# Altium schematic sheet buck-boost-converter.SchDoc
size A3; DocumentNumber: 42; SheetNumber: 42; SheetTotal: 45; SheetDescription: Buck-boost Converter
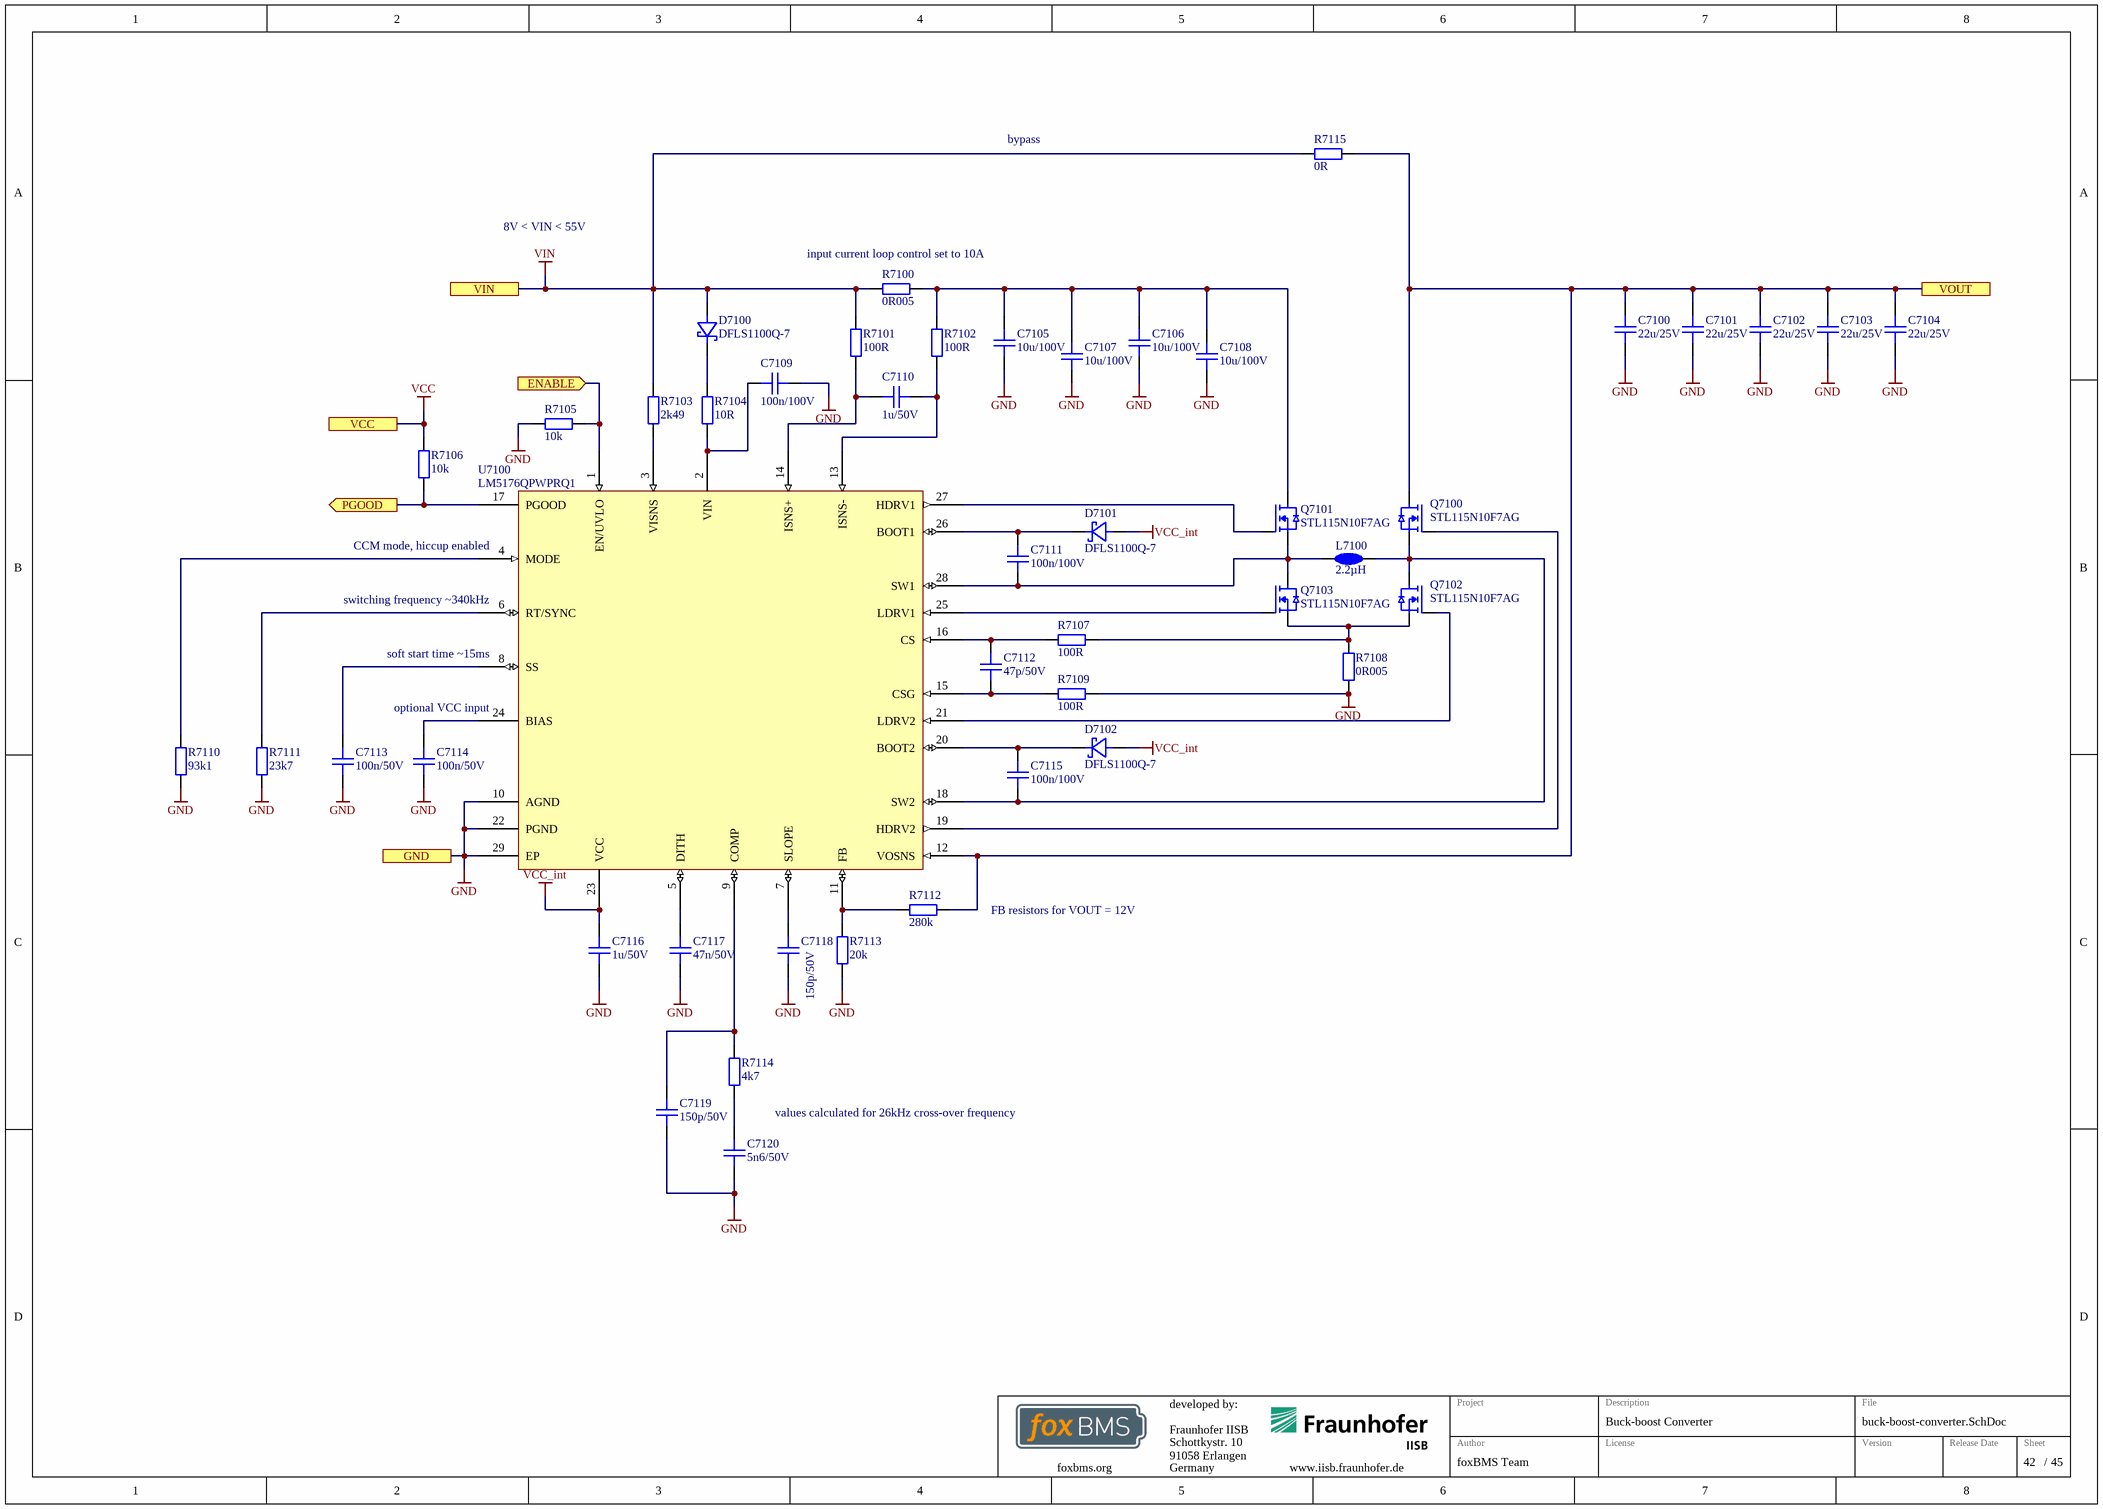
[diagram p0: buck-boost-converter.SchDoc]

## Parts
C7100  22u/25V  [CAPC3225X25N]
C7101  22u/25V  [CAPC3225X25N]
C7102  22u/25V  [CAPC3225X25N]
C7103  22u/25V  [CAPC3225X25N]
C7104  22u/25V  [CAPC3225X25N]
C7105  10u/100V  [CAPC5750X28N]
C7106  10u/100V  [CAPC5750X28N]
C7107  10u/100V  [CAPC5750X28N]
C7108  10u/100V  [CAPC5750X28N]
C7109  100n/100V  [CAPC1608X08N]
C7110  1u/50V  [CAPC1608X08N]
C7111  100n/100V  [CAPC1608X08N]
C7112  47p/50V  [CAPC1005X06N]
C7113  100n/50V  [CAPC1005X06N]
C7114  100n/50V  [CAPC1005X06N]
C7115  100n/100V  [CAPC1608X08N]
C7116  1u/50V  [CAPC1608X08N]
C7117  47n/50V  [CAPC1005X06N]
C7118  150p/50V  [CAPC1005X06N]
C7119  150p/50V  [CAPC1005X06N]
C7120  5n6/50V  [CAPC1608X08N]
D7100  DFLS1100Q-7  [PowerDI123]
D7101  DFLS1100Q-7  [PowerDI123]
D7102  DFLS1100Q-7  [PowerDI123]
L7100  2.2µH  [COILCRAFT_XAL1010]
Q7100  STL115N10F7AG  [ST_PowerFLAT_5x6_WF_type_C]
Q7101  STL115N10F7AG  [ST_PowerFLAT_5x6_WF_type_C]
Q7102  STL115N10F7AG  [ST_PowerFLAT_5x6_WF_type_C]
Q7103  STL115N10F7AG  [ST_PowerFLAT_5x6_WF_type_C]
R7100  0R005  [PANASONIC_ERJMS4H]
R7101  100R  [RESC1005X04N]
R7102  100R  [RESC1005X04N]
R7103  2k49  [RESC1005X04N]
R7104  10R  [RESC1005X04N]
R7105  10k  [RESC1005X04N]
R7106  10k  [RESC1005X04N]
R7107  100R  [RESC1005X04N]
R7108  0R005  [PANASONIC_ERJMS4H]
R7109  100R  [RESC1005X04N]
R7110  93k1  [RESC1005X04N]
R7111  23k7  [RESC1005X04N]
R7112  280k  [RESC1005X04N]
R7113  20k  [RESC1005X04N]
R7114  4k7  [RESC1005X04N]
R7115  0R  [RESC6331X07N]
U7100  LM5176QPWPRQ1  [LM5176-PWP]

## Ports
ENABLE (in), GND, PGOOD (out), VCC, VIN, VOUT

## Nets
GND: C7100.1 C7101.1 C7102.1 C7103.1 C7104.1 C7105.1 C7106.1 C7107.1 C7108.1 C7109.1 C7113.2 C7114.2 C7116.2 C7117.1 C7118.1 C7119.1 C7120.1 R7105.2 R7108.1 R7109.1 R7110.1 R7111.1 R7113.1 U7100.10(AGND) U7100.22(PGND) U7100.29(EP) ; port GND
VCC: R7106.2 ; port VCC
VCC_int: C7116.1 D7101.2(A) D7102.2(A) U7100.23(VCC)
VIN: D7100.2(A) R7100.1 R7101.2 R7103.2 R7115.1 ; port VIN
ENABLE: R7105.1 U7100.1(EN/UVLO) ; port ENABLE
PGOOD: R7106.1 U7100.17(PGOOD) ; port PGOOD
VOUT: C7100.2 C7101.2 C7102.2 C7103.2 C7104.2 Q7100.D R7112.1 R7115.2 U7100.12(VOSNS) ; port VOUT
NetC7105_2: C7105.2 C7106.2 C7107.2 C7108.2 Q7101.D R7100.2 R7102.2
NetC7109_2: C7109.2 R7104.1 U7100.2(VIN)
NetC7110_1: C7110.1 R7102.1 U7100.13(ISNS-)
NetC7110_2: C7110.2 R7101.1 U7100.14(ISNS+)
NetC7111_1: C7111.1 D7101.1(K) U7100.26(BOOT1)
NetC7111_2: C7111.2 L7100.1 Q7101.S Q7103.D U7100.28(SW1)
NetC7112_1: C7112.1 R7109.2 U7100.15(CSG)
NetC7112_2: C7112.2 R7107.2 U7100.16(CS)
NetC7113_1: C7113.1 U7100.8(SS)
NetC7114_1: C7114.1 U7100.24(BIAS)
NetC7115_1: C7115.1 D7102.1(K) U7100.20(BOOT2)
NetC7115_2: C7115.2 L7100.2 Q7100.S Q7102.D U7100.18(SW2)
NetC7117_2: C7117.2 U7100.5(DITH)
NetC7118_2: C7118.2 U7100.7(SLOPE)
NetC7119_2: C7119.2 R7114.2 U7100.9(COMP)
NetC7120_2: C7120.2 R7114.1
NetD7100_1: D7100.1(K) R7104.2
NetQ7100_G: Q7100.G U7100.19(HDRV2)
NetQ7101_G: Q7101.G U7100.27(HDRV1)
NetQ7102_G: Q7102.G U7100.21(LDRV2)
NetQ7102_S: Q7102.S Q7103.S R7107.1 R7108.2
NetQ7103_G: Q7103.G U7100.25(LDRV1)
NetR7103_1: R7103.1 U7100.3(VISNS)
NetR7110_2: R7110.2 U7100.4(MODE)
NetR7111_2: R7111.2 U7100.6(RT/SYNC)
NetR7112_2: R7112.2 R7113.2 U7100.11(FB)

## Notes on the sheet
- bypass
- 8V < VIN < 55V
- (near R7100) input current loop control set to 10A
- (near U7100) CCM mode, hiccup enabled
- (near U7100) switching frequency ~340kHz
- (near U7100) soft start time ~15ms
- optional VCC input
- FB resistors for VOUT = 12V
- values calculated for 26kHz cross-over frequency
- Fraunhofer IISB
- Schottkystr. 10
- developed by:
- 91058 Erlangen
- Germany
- Author
- Project
- License
- Description
- File
- Version
- Release Date
- Sheet
- foxbms.org <https://foxbms.org>
- www.iisb.fraunhofer.de <https://www.iisb.fraunhofer.de/>
- foxBMS Team
- /

## Library data of the parts
C7100-C7104 = gen_C_ceramic_22u_25V_X7R_1210: MLCC; Capacitance: 22u; Rated Voltage: 25V; Dielectric: X7R; Case EIA: 1210; Case Metric: 3225; Automotive Qualified: True; Part Number: gen_C_ceramic_22u_25V_X7R_1210; Supplier 1: Digikey; Supplier Part Number 1: 445-180363-1-ND
C7105-C7108 = gen_C_ceramic_10u_100V_X7S_2220: MLCC; Capacitance: 10u; Rated Voltage: 100V; Dielectric: X7S; Case EIA: 2220; Case Metric: 5750; Automotive Qualified: True; AEC-Q Grade: Grade 0; AEC-Q Norm: AEC-Q200; Part Number: gen_C_ceramic_10u_100V_X7S_2220; Supplier 1: Digikey; Supplier Part Number 1: 445-13152-1-ND; ECCN: EAR99
C7109 C7111 C7115 = gen_C_ceramic_100n_100V_X7R_0603: MLCC; Capacitance: 100n; Rated Voltage: 100V; Dielectric: X7R; Case EIA: 0603; Case Metric: 1608; Automotive Qualified: True; PnP Package: 0603C; Part Number: gen_C_ceramic_100n_100V_X7R_0603; Supplier 1: Digikey; Supplier Part Number 1: 490-13420-1-ND; Supplier 2: Mouser; Supplier Part Number 2: 81-GCJ188R72A104KA1D
C7110 C7116 = gen_C_ceramic_1u_50V_X7R_0603: MLCC; Capacitance: 1u; Rated Voltage: 50V; Dielectric: X7R; Tolerance: ± 10%; Case EIA: 0603; Case Metric: 1608; Automotive Qualified: False; PnP Package: 0603C; Part Number: gen_C_ceramic_1u_50V_X7R_0603; Operating Temperature: -55°C - +125°C; Supplier 1: Farnell; Supplier Part Number 1: 2779055
C7112 = gen_C_ceramic_47p_50V_C0G_0402: MLCC; Capacitance: 47p; Rated Voltage: 50V; Dielectric: C0G; Case EIA: 0402; Case Metric: 1005; Automotive Qualified: True; PnP Package: 0402C; Part Number: gen_C_ceramic_47p_50V_C0G_0402; Supplier 1: Digikey; Supplier Part Number 1: 490-10670-1-ND
C7113 C7114 = gen_C_ceramic_100n_50V_X7R_0402: MLCC; Capacitance: 100n; Rated Voltage: 50V; Dielectric: X7R; Case EIA: 0402; Case Metric: 1005; Automotive Qualified: True; PnP Package: 0402C; PnP Value: 100nF/50V/X7R; PnP equipped: x; AEC-Q Norm: AEC-Q200; Part Number: gen_C_ceramic_100n_50V_X7R_0402; Supplier 1: Farnell; Supplier Part Number 1: 2210822; ECCN: EAR99
C7117 = gen_C_ceramic_47n_50V_X7R_0402: MLCC; Capacitance: 47n; Rated Voltage: 50V; Dielectric: X7R; Case EIA: 0402; Case Metric: 1005; Automotive Qualified: True; PnP Package: 0402C; Part Number: gen_C_ceramic_47n_50V_X7R_0402; Supplier 1: Farnell; Supplier Part Number 1: 2210827
C7118 C7119 = gen_C_ceramic_150p_50V_C0G_0402: MLCC; Capacitance: 150p; Rated Voltage: 50V; Dielectric: C0G; Case EIA: 0402; Case Metric: 1005; Automotive Qualified: True; PnP Package: 0402C; Part Number: gen_C_ceramic_150p_50V_C0G_0402; Supplier 1: Digikey; Supplier Part Number 1: 490-4926-1-ND
C7120 = gen_C_ceramic_5n6_50V_C0G_0603: MLCC; Capacitance: 5n6; Rated Voltage: 50V; Dielectric: C0G; Case EIA: 0603; Case Metric: 1608; Automotive Qualified: True; PnP Package: 0603C; Part Number: gen_C_ceramic_5n6_50V_C0G_0603; Supplier 1: Farnell; Supplier Part Number 1: 2210857
D7100-D7102 = DFLS1100Q-7: Schottky Diode; Manufacturer: Diodes Inc.; Breakdown Voltage: 100V; Continuous Forward Current: 1A; Automotive Qualified: True; Part Number: DFLS1100Q-7; Part Name: DFLS1100Q-7; Operating Temperature: −55°C - +175°C; ComponentLink1Description: Datasheet; ComponentLink1URL: https://www.diodes.com/assets/Datasheets/ds30497.pdf; Supplier 1: Mouser; Supplier Part Number 1: 621-DFLS1-100Q-7; Supplier 2: Digikey; Supplier Part Number 2: DFLS1100Q-7DICT-ND; Supplier 3: Farnell; Supplier Part Number 3: 3127293; PnP Package: POWERDI123
L7100 = XAL1010-222MEB: Power Inductor; Manufacturer: Coilcraft; Rated Current: 24.5A; Saturation Current: 34A; Automotive Qualified: True; Part Number: XAL1010-222MEB; Operating Temperature: -40°C - +125°C; ComponentLink1Description: Datasheet; ComponentLink1URL: http://www.coilcraft.com/pdfs/xal1010.pdf; Inductance: 2.2µH; Supplier 1: Mouser; Supplier Part Number 1: 994-XAL1010-222MEB
Q7100-Q7103 = STL115N10F7AG: N-Channel MOSFET, 100 V, 107 A, 5 mOhm; Manufacturer: STMicroelectronics; Maximum Drain-Source Voltage: 100V; Maximum Continous Drain Current (25°C): 107A; R_DS(on): 5m; Total Gate Charge: 72.5nC; Automotive Qualified: True; AEC-Q Norm: AEC-Q101; AEC-Q Grade: Grade 0; Part Number: STL115N10F7AG; Part Name: NMOS; Operating Temperature: -55°C - +175°C; ComponentLink1Description: Datasheet; ComponentLink1URL: https://www.mouser.de/datasheet/2/389/dm00333356-1798814.pdf; Supplier 1: Mouser; Supplier Part Number 1: 511-STL115N10F7AG; Supplier 2: Digikey; Supplier Part Number 2: 497-17622-1-ND; ECCN: EAR99
R7100 R7108 = ERJ-MS4HF5M0U: SMD Shunt Resistor 0R005; Tolerance: 1%; Power: 3W; Case EIA: 2512; Automotive Qualified: True; Part Number: ERJ-MS4HF5M0U; Operating Temperature: -65°C - +170°C; Resistance: 0R005; Supplier 1: Digikey; Supplier Part Number 1: P17093CT-ND
R7101 R7102 R7107 R7109 = gen_R_100R_0402: SMD Resistor 100R 0402; Tolerance: 1%; Power: 0.063W; Case EIA: 0402; Case Metric: 1005; Maximum Working Voltage: 50V; PnP Package: 0402R; PnP equipped: x; Automotive Qualified: True; AEC-Q Norm: AEC-Q200; Part Number: gen_R_100R_0402; Operating Temperature: -55°C - +155°C; Resistance: 100R; Series: E24, E96; PnP Value: 100R; Supplier 1: Farnell; Supplier Part Number 1: 2302528; ECCN: EAR99
R7103 = gen_R_2k49_0402: SMD Resistor 2k49 0402; Tolerance: 1%; Power: 0.063W; Case EIA: 0402; Case Metric: 1005; Maximum Working Voltage: 50V; PnP Package: 0402R; Automotive Qualified: True; Part Number: gen_R_2k49_0402; Operating Temperature: -55°C - +155°C; Resistance: 2k49; Series: E96; PnP Value: 2k49; Supplier 1: Farnell; Supplier Part Number 1: 2059135
R7104 = gen_R_10R_0402: SMD Resistor 10R 0402; Tolerance: 1%; Power: 0.063W; Case EIA: 0402; Case Metric: 1005; Maximum Working Voltage: 50V; PnP Package: 0402R; Automotive Qualified: True; Part Number: gen_R_10R_0402; Operating Temperature: -55°C - +155°C; Resistance: 10R; Series: E24, E96; PnP Value: 10R; Supplier 1: Farnell; Supplier Part Number 1: 2302417
R7105 R7106 = gen_R_10k_0402: SMD Resistor 10k 0402; Tolerance: 1%; Power: 0.063W; Case EIA: 0402; Case Metric: 1005; Maximum Working Voltage: 50V; PnP Package: 0402R; PnP equipped: x; Automotive Qualified: True; AEC-Q Norm: AEC-Q200; Part Number: gen_R_10k_0402; Operating Temperature: -55°C - +155°C; Resistance: 10k; Series: E24, E96; PnP Value: 10k; Supplier 1: Farnell; Supplier Part Number 1: 2059239; ECCN: EAR99
R7110 = gen_R_93k1_0402: SMD Resistor 93k1 0402; Tolerance: 1%; Power: 0.063W; Case EIA: 0402; Case Metric: 1005; Maximum Working Voltage: 50V; PnP Package: 0402R; Automotive Qualified: True; AEC-Q Grade: Grade 0; AEC-Q Norm: AEC-Q200; Part Number: gen_R_93k1_0402; Operating Temperature: -55°C - +155°C; Resistance: 93k1; Series: E96; PnP Value: 93k1; ECCN: EAR99; Supplier 1: Farnell; Supplier Part Number 1: 2302836
R7111 = gen_R_23k7_0402: SMD Resistor 23k7 0402; Tolerance: 1%; Power: 0.063W; Case EIA: 0402; Case Metric: 1005; Maximum Working Voltage: 50V; PnP Package: 0402R; Automotive Qualified: True; AEC-Q Grade: Grade 0; AEC-Q Norm: AEC-Q200; Part Number: gen_R_23k7_0402; Operating Temperature: -55°C - +155°C; Resistance: 23k7; Series: E96; PnP Value: 23k7; ECCN: EAR99; Supplier 1: Farnell; Supplier Part Number 1: 2302775
R7112 = gen_R_280k_0402: SMD Resistor 280k 0402; Tolerance: 1%; Power: 0.063W; Case EIA: 0402; Case Metric: 1005; Maximum Working Voltage: 50V; PnP Package: 0402R; Automotive Qualified: True; AEC-Q Grade: Grade 0; AEC-Q Norm: AEC-Q200; Part Number: gen_R_280k_0402; Operating Temperature: -55°C - +155°C; Resistance: 280k; Series: E96; PnP Value: 280k; ECCN: EAR99; Supplier 1: Farnell; Supplier Part Number 1: 2302887
R7113 = gen_R_20k_0402: SMD Resistor 20k 0402; Tolerance: 1%; Power: 0.063W; Case EIA: 0402; Case Metric: 1005; Maximum Working Voltage: 50V; PnP Package: 0402R; PnP equipped: x; Automotive Qualified: True; AEC-Q Norm: AEC-Q200; Part Number: gen_R_20k_0402; Operating Temperature: -55°C - +155°C; Resistance: 20k; Series: E24, E96; PnP Value: 20k; Supplier 1: Farnell; Supplier Part Number 1: 2059242; Supplier 2: Farnell; Supplier Part Number 2: 2059160; ECCN: EAR99
R7114 = gen_R_4k7_0402: SMD Resistor 4k7 0402; Tolerance: 1%; Power: 0.063W; Case EIA: 0402; Case Metric: 1005; Maximum Working Voltage: 50V; PnP Package: 0402R; Automotive Qualified: True; PnP equipped: x; Part Number: gen_R_4k7_0402; Operating Temperature: -55°C - +155°C; Resistance: 4k7; Series: E24; PnP Value: 4k7; Supplier 1: Farnell; Supplier Part Number 1: 2302707
R7115 = gen_R_0R_2512: SMD Resistor 0R 2512; Power: 1W; Case EIA: 2512; Case Metric: 6432; Maximum Working Voltage: 500V; PnP Package: 2512R; Automotive Qualified: True; Part Number: gen_R_0R_2512; Operating Temperature: -55°C - +155°C; Resistance: 0R; Series: Jumper; PnP Value: 0R; Supplier 1: Farnell; Supplier Part Number 1: 2309110
U7100 = LM5176QPWPRQ1: 55-V wide VIN synchronous 4-switch buck-boost controller; Manufacturer: Texas Instruments; PnP Package: HTSSOP-28; Automotive Qualified: True; Part Number: LM5176QPWPRQ1; Part Name: LM5176QPWPRQ1; Operating Temperature: −40°C - +125°C; ComponentLink1Description: Datasheet; ComponentLink1URL: http://www.ti.com/lit/ds/symlink/lm5176-q1.pdf; Supplier 1: Mouser; Supplier Part Number 1: 595-LM5176QPWPRQ1